# Altium schematic sheet AIM2 - GPS Multiplexing REVB.SchDoc: GPS UART Multiplexing
size B; DrawnBy: DJW; DocumentNumber: 8; SheetNumber: 8; SheetTotal: 12
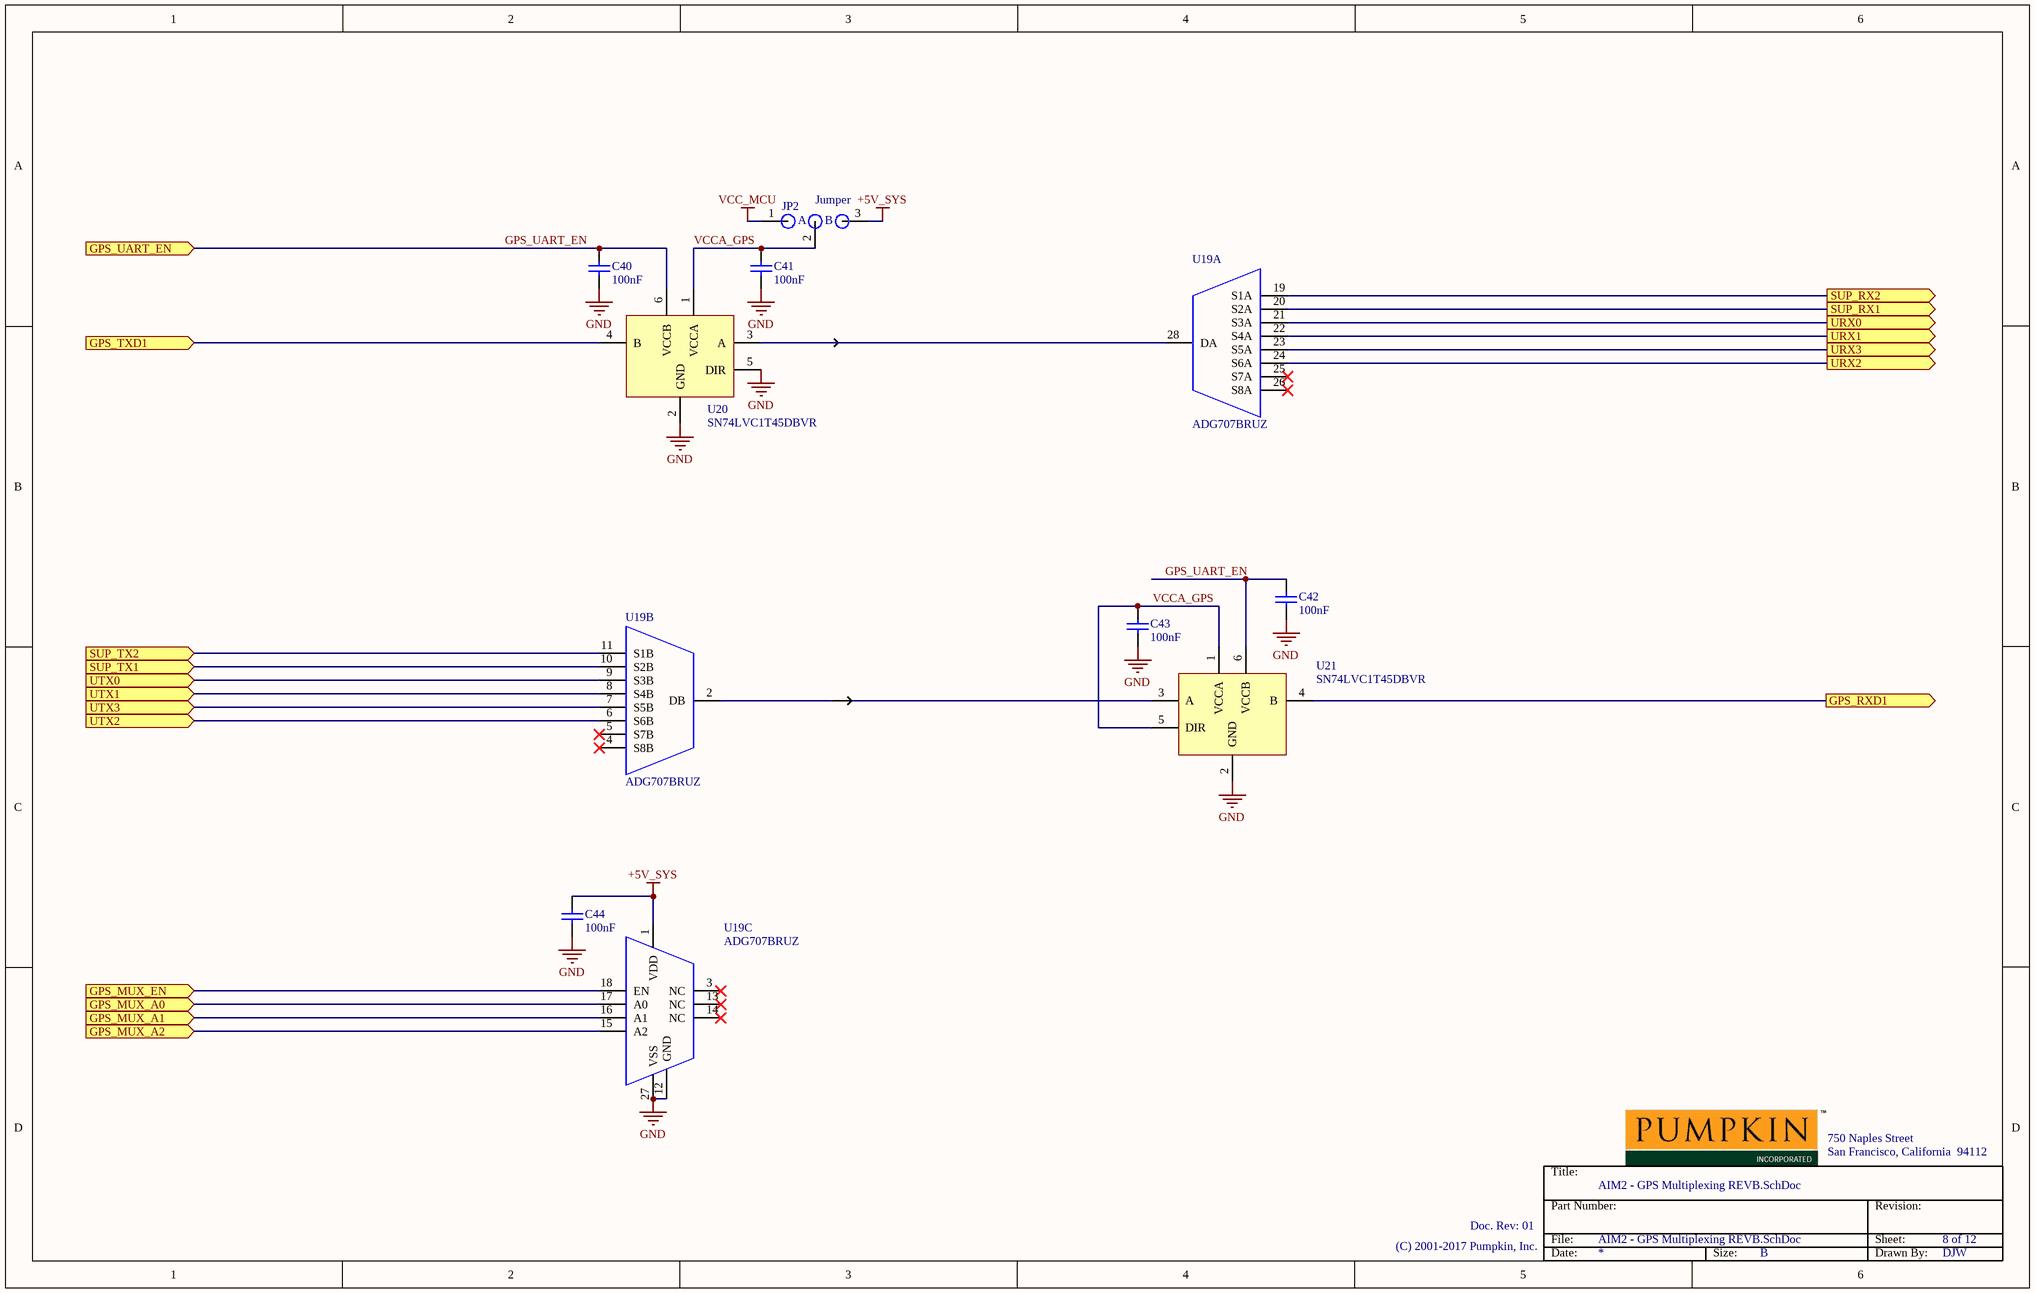
[diagram p0: AIM2 - GPS Multiplexing REVB.SchDoc]

## Parts
C40  100nF  [0603 CAP]
C41  100nF  [0603 CAP]
C42  100nF  [0603 CAP]
C43  100nF  [0603 CAP]
C44  100nF  [0603 CAP]
JP2  Jumper  [0805 RES 2 way jumper - 1]
U19  ADG707BRUZ  [28-TSSOP]  (parts A,B,C of 3)
U20  SN74LVC1T45DBVR  [SOT23-6]
U21  SN74LVC1T45DBVR  [SOT23-6]

## Ports
GPS_MUX_A0 (in), GPS_MUX_A1 (in), GPS_MUX_A2 (in), GPS_MUX_EN (in), GPS_RXD1 (out), GPS_TXD1 (in), GPS_UART_EN (in), SUP_RX1 (out), SUP_RX2 (out), SUP_TX1 (in), SUP_TX2 (in), URX0 (out), URX1 (out), URX2 (out), URX3 (out), UTX0 (in), UTX1 (in), UTX2 (in), UTX3 (in)

## Nets
+5V_SYS: C44.2 JP2.3 U19.1(VDD)
GND: C40.1 C41.1 C42.1 C43.1 C44.1 U19.12(GND) U19.27(VSS) U20.2(GND) U20.5(DIR) U21.2(GND)
VCC_MCU: JP2.1
GPS_MUX_A0: U19.17(A0) ; port GPS_MUX_A0
GPS_MUX_A1: U19.16(A1) ; port GPS_MUX_A1
GPS_MUX_A2: U19.15(A2) ; port GPS_MUX_A2
GPS_MUX_EN: U19.18(EN) ; port GPS_MUX_EN
GPS_RXD1: U21.4(B) ; port GPS_RXD1
GPS_TXD1: U20.4(B) ; port GPS_TXD1
GPS_UART_EN: C40.2 C42.2 U20.6(VCCB) U21.6(VCCB) ; port GPS_UART_EN
SUP_RX1: U19.20(S2A) ; port SUP_RX1
SUP_RX2: U19.19(S1A) ; port SUP_RX2
SUP_TX1: U19.10(S2B) ; port SUP_TX1
SUP_TX2: U19.11(S1B) ; port SUP_TX2
URX0: U19.21(S3A) ; port URX0
URX1: U19.22(S4A) ; port URX1
URX2: U19.24(S6A) ; port URX2
URX3: U19.23(S5A) ; port URX3
UTX0: U19.9(S3B) ; port UTX0
UTX1: U19.8(S4B) ; port UTX1
UTX2: U19.6(S6B) ; port UTX2
UTX3: U19.7(S5B) ; port UTX3
VCCA_GPS: C41.2 C43.2 JP2.2 U20.1(VCCA) U21.1(VCCA) U21.5(DIR)
NetU19_2: U19.2(DB) U21.3(A)
NetU19_28: U19.28(DA) U20.3(A)

Not connected (* = marked no-connect by the designer): U19 3(NC)* 4(S8B)* 5(S7B)* 13(NC)* 14(NC)* 25(S7A)* 26(S8A)*

## Notes on the sheet
- Title:
- 750 Naples Street
- San Francisco, California  94112
- Doc. Rev: 01
- File:
- Part Number:
- Revision:
- Sheet:
- (C) 2001-2017 Pumpkin, Inc.
- Date:
- Size:
- B
- Drawn By:
- (in symbol Jumper 2 way 0805) A; B

## Library data of the parts
C40-C44 = Capacitor 100nF 0603: Capacitor 100nF 0603 X7R 50V 5%; Value: 100nF; Supplier 1: Digi-Key; Supplier Part Number 1: 399-7844-1-ND
JP2 = Jumper 2 way 0805: Jumper 0805 2 pos; Supplier 1: Digi-Key; Supplier Part Number 1: P0.0ACT-ND
U19 = ADG707BRUZ: IC Multiplexer 2x 8:1; Supplier 1: Digi-Key; Supplier Part Number 1: ADG707BRUZ-ND
U20 U21 = SN74LVC1T45DBVR: IC Logic Isolator 1 channel; Supplier 1: Digi-Key; Supplier Part Number 1: 296-16843-1-ND